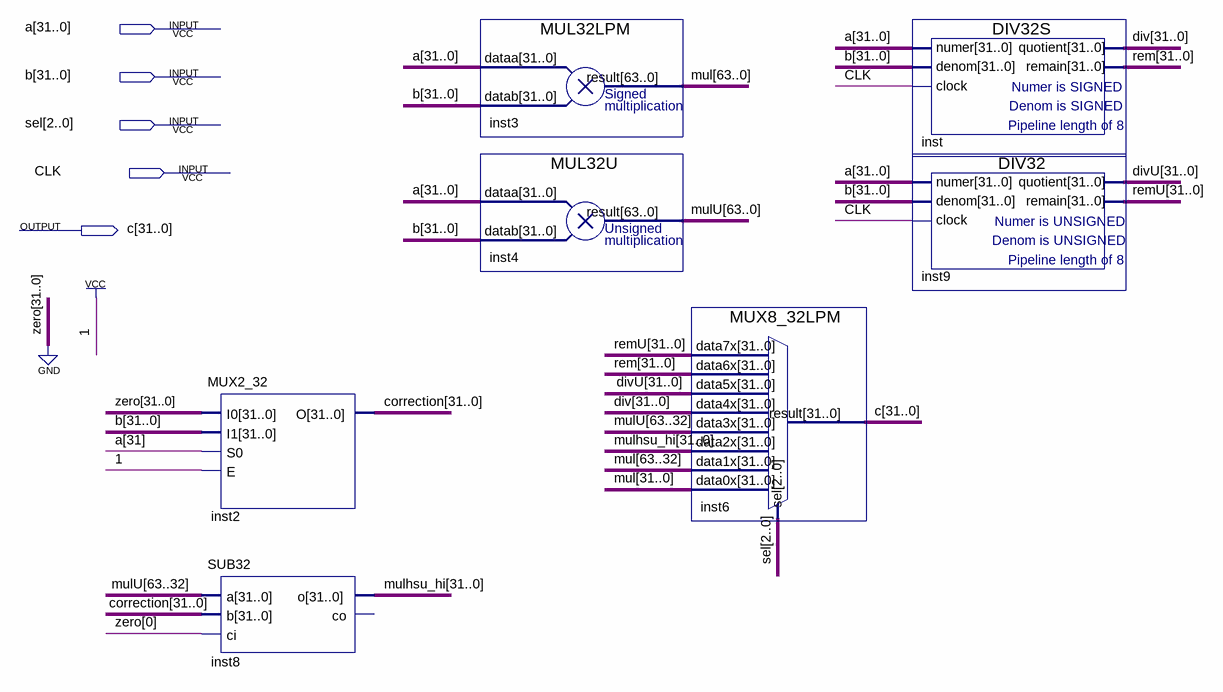
[diagram p0: schematic sheet]
// Quartus schematic MULDIVALU.bdf as structural Verilog: 7 symbols, 5 pins
module MULDIVALU (
  input  [31:0] a,
  input  [31:0] b,
  input  [2:0] sel,
  input  CLK,
  output [31:0] c
);

  wire [31:0] correction, div, divU, mulhsu_hi, rem, remU;
  wire [63:0] mul, mulU;

  MUX2_32 inst2 (.I0({32{1'b0}}), .I1(b), .S0(a[31]), .E(1'b1), .O(correction));
  SUB32 inst8 (.a(mulU[63:32]), .b(correction), .ci(1'b0), .o(mulhsu_hi));  // open: co
  MUL32LPM inst3 (.dataa(a), .datab(b), .result(mul));
  MUL32U inst4 (.dataa(a), .datab(b), .result(mulU));
  MUX8_32LPM inst6 (
    .data7x(remU), .data6x(rem), .data5x(divU), .data4x(div), .data3x(mulU[63:32]), .data2x(mulhsu_hi),
    .data1x(mul[63:32]), .data0x(mul[31:0]), .sel(sel), .result(c));
  DIV32S inst (.numer(a), .denom(b), .clock(CLK), .quotient(div), .remain(rem));
  DIV32 inst9 (.numer(a), .denom(b), .clock(CLK), .quotient(divU), .remain(remU));
endmodule
